# EAGLE board StearnsN2b (EAGLE 6.6.0)
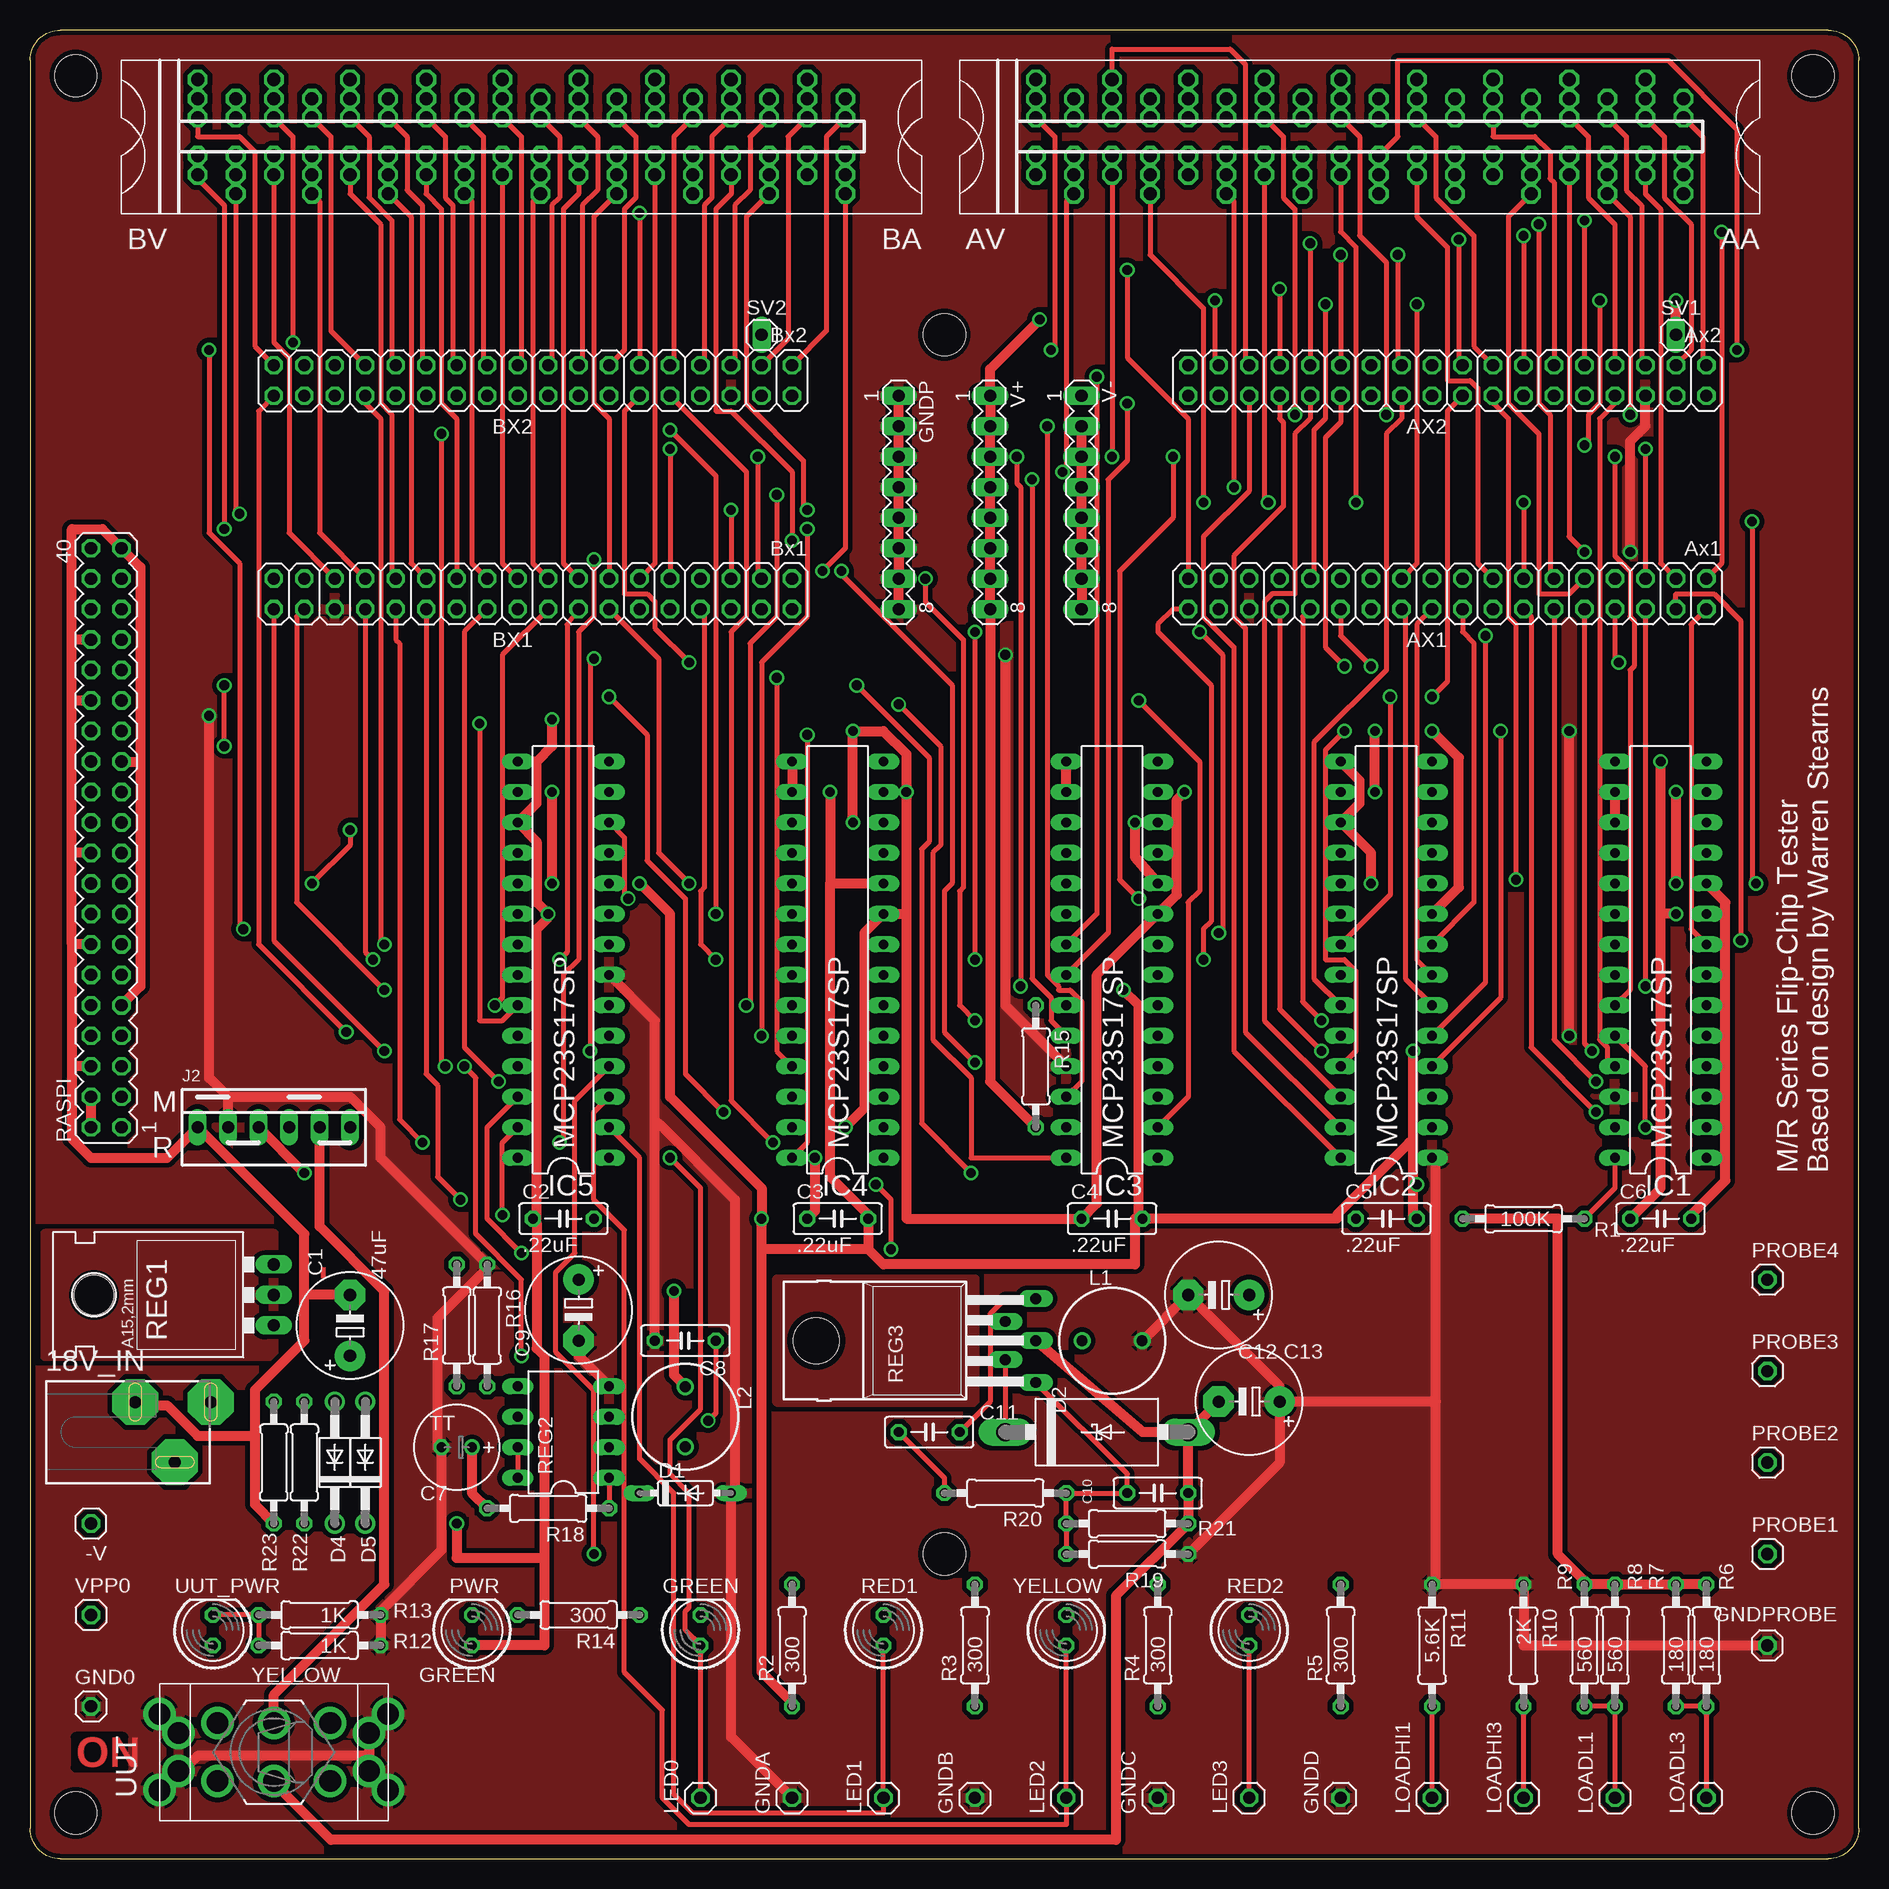
[diagram p1: board, top side]
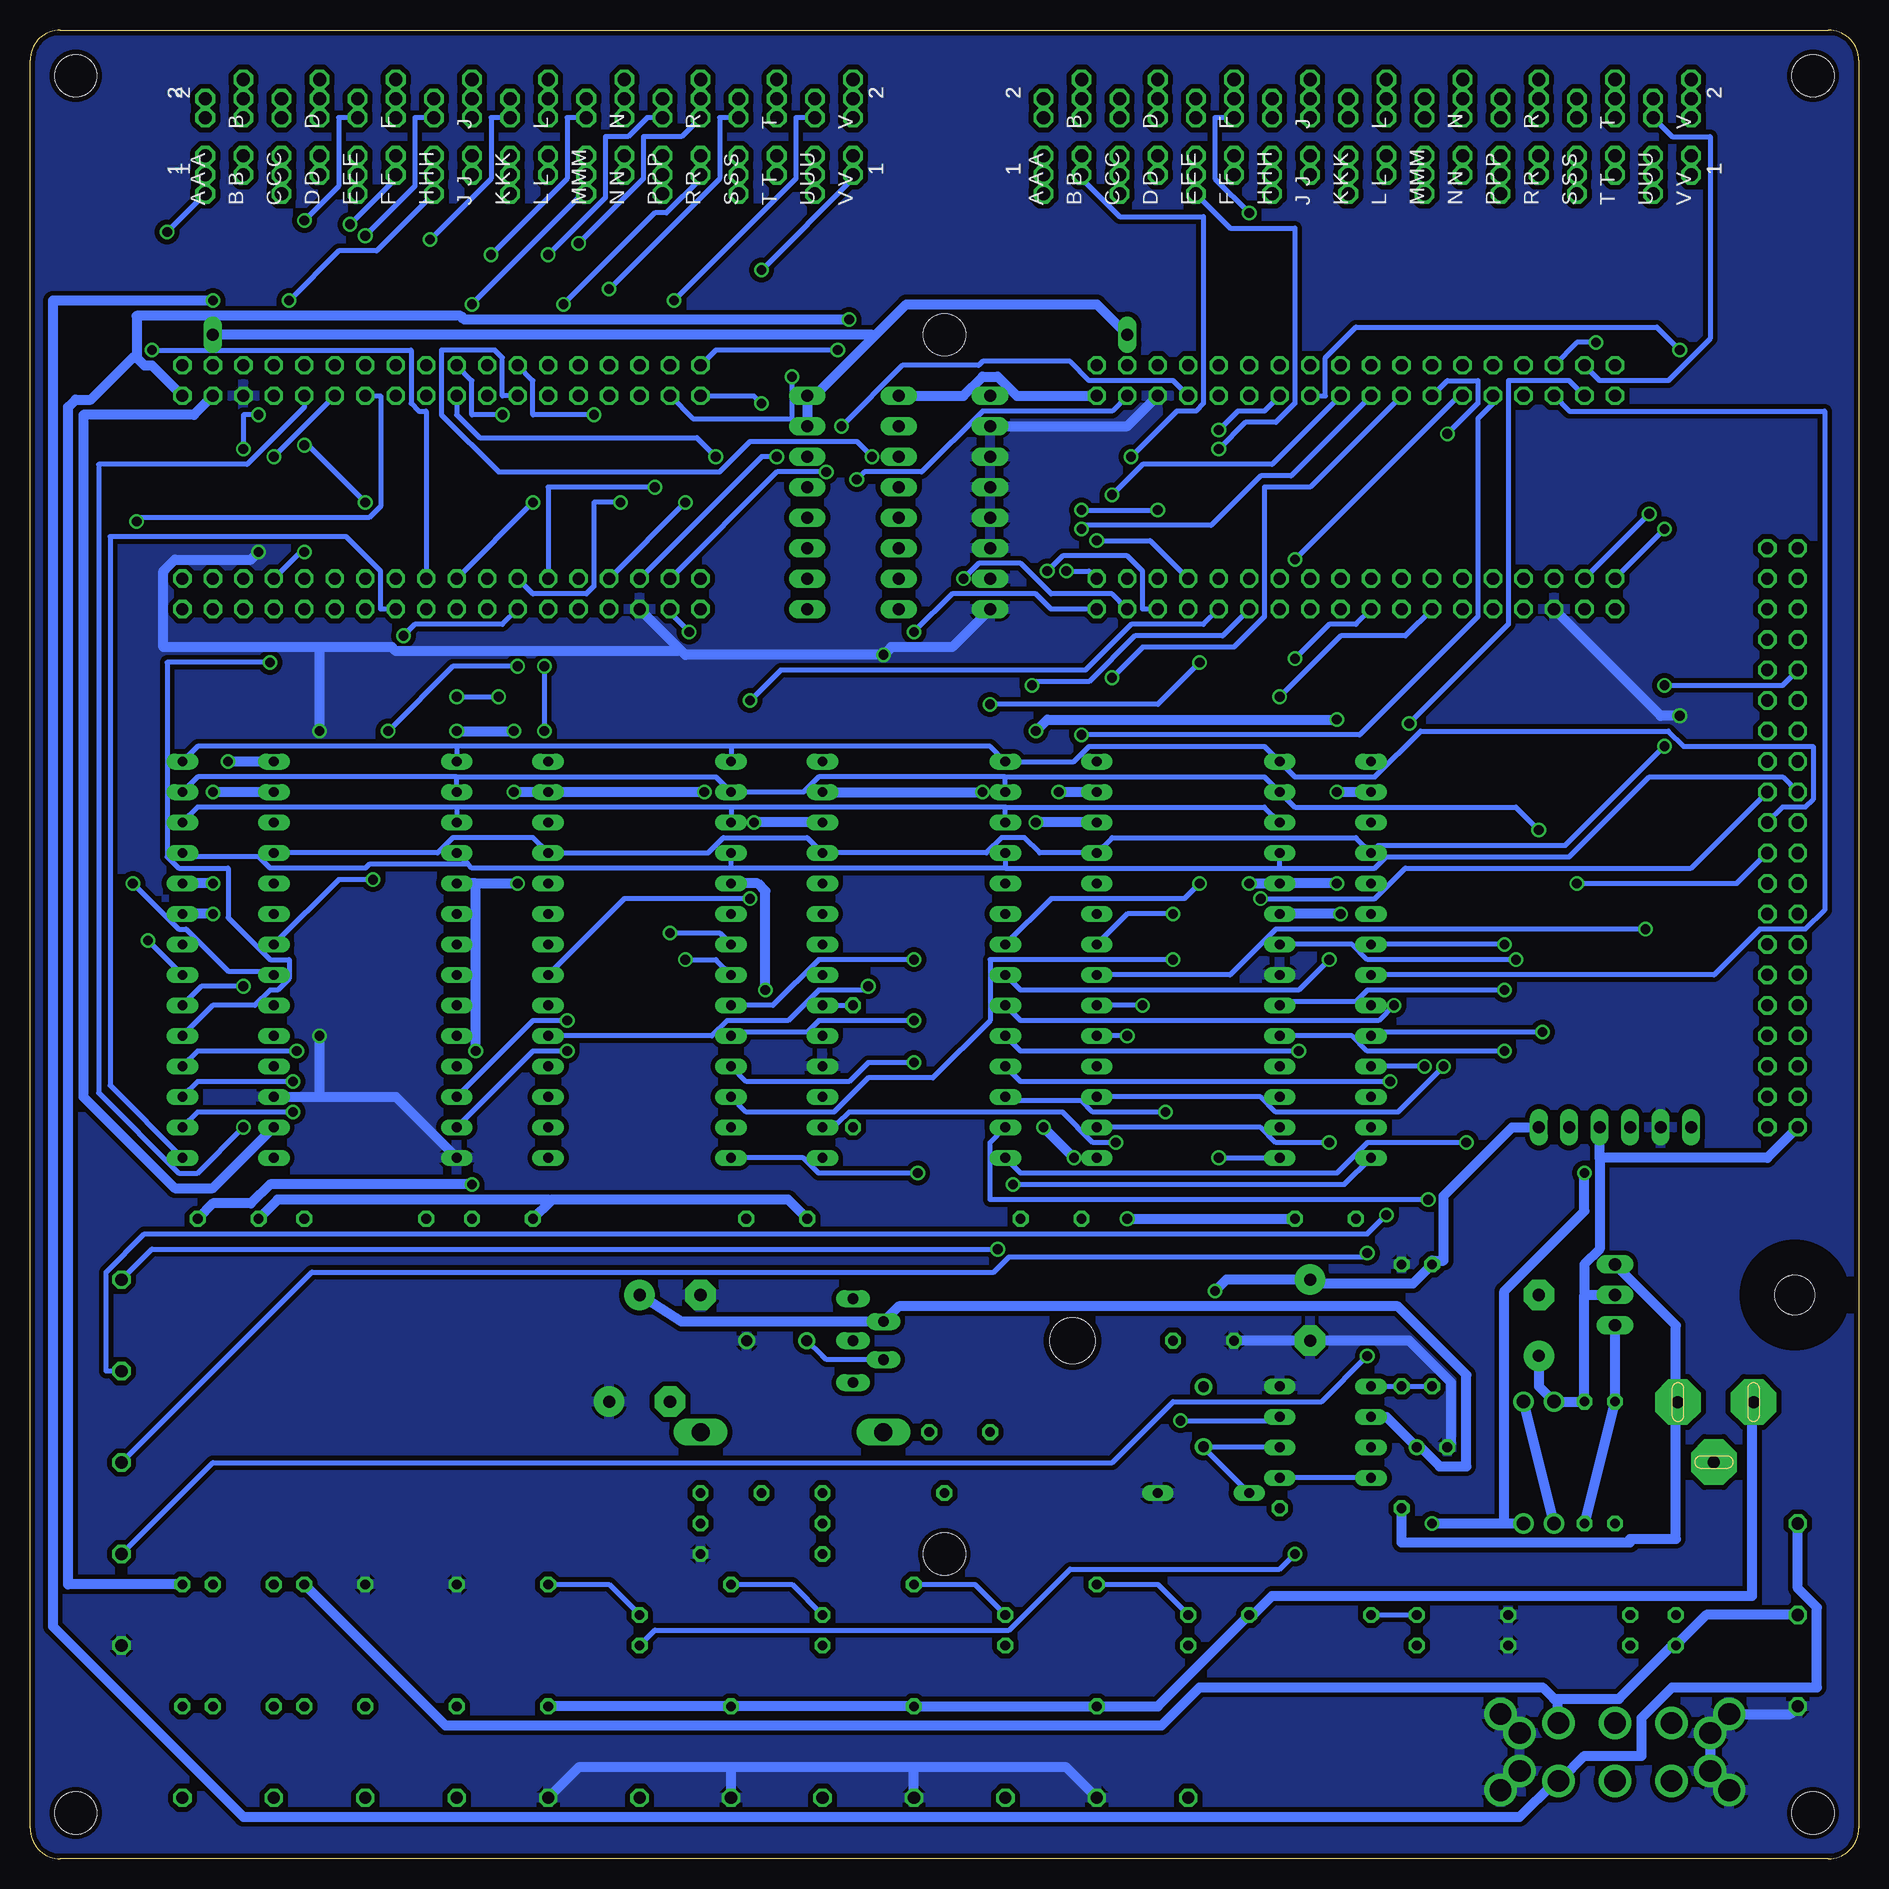
[diagram p2: board, bottom side, seen from below]

Size 152.4 x 152.4 mm. Coordinates in mm from the lower left corner, seen from the top.
Outline: 149.86,152.4 2.54,152.4 arc90 0,149.86 0,2.54 arc90 2.54,0 149.86,0 arc90 152.4,2.54 152.4,149.86 arc90 149.86,152.4
Copper layers (1+16): Top 0.035mm / dielectric 1.5mm / Bottom 0.035mm
Design rules "16mils *": minimum track width 16mil, minimum drill 32mil, track to track 15mil, track to pad 10mil, pad to pad 10mil, via to via 10mil, smd to smd 10mil, copper to edge 13mil, drill to drill 10mil, minimum pad ring 10mil, minimum via ring 8mil, stop-mask expansion 0mil, vias tented up to drill 0mil, thermal gap 10mil
Net classes: 1 Supply: width 0.813 mm
Holes 3.51 mm at 148.59,148.59 3.81,148.59 3.81,3.81 148.59,3.81 76.2,127 76.2,25.4
vRestrict: area 144.8,57.1 to 149.9,97.8

## Footprints (pad centres in the part's own frame; a part is rotated, then mirrored left to right if it is on the bottom)
SCD-014-A = drill 1 pad 3.81 octagon: 1 -2.5,13.8; 2 -2.5,7.5; 3 2.5,10.8
1X01 = drill 1.016 octagon: 1 0,0
2X18 = drill 1.016 octagon: 1 -21.59,-1.27; 2 -21.59,1.27; 3 -19.05,-1.27; 4 -19.05,1.27; 5 -16.51,-1.27; 6 -16.51,1.27; 7 -13.97,-1.27; 8 -13.97,1.27; 9 -11.43,-1.27; 10 -11.43,1.27; 11 -8.89,-1.27; 12 -8.89,1.27; 13 -6.35,-1.27; 14 -6.35,1.27; 15 -3.81,-1.27; 16 -3.81,1.27; 17 -1.27,-1.27; 18 -1.27,1.27; 19 1.27,-1.27; 20 1.27,1.27; 21 3.81,-1.27; 22 3.81,1.27; 23 6.35,-1.27; 24 6.35,1.27; 25 8.89,-1.27; 26 8.89,1.27; 27 11.43,-1.27; 28 11.43,1.27; 29 13.97,-1.27; 30 13.97,1.27; 31 16.51,-1.27; 32 16.51,1.27; 33 19.05,-1.27; 34 19.05,1.27; 35 21.59,-1.27; 36 21.59,1.27
E5-8,5 = drill 1.016 pad 2.54: + -2.54,0 | drill 1.016 pad 2.54 octagon: - 2.54,0
C050-025X075 = drill 0.813 octagon: 1 -2.54,0; 2 2.54,0
TT2D7 = drill 0.813: + -1.27,0 | drill 0.813 octagon: - 1.27,0
DO35-7 = drill 0.813 long: A 3.81,0; C -3.81,0
DO201T15 = drill 1.499 long: A 7.62,0; C -7.62,0
DO41-10 = drill 1.118: A 5.08,0; C -5.08,0
H807-2 = drill 1.092 octagon: AA1 4.763,60.325; AA2 -1.587,60.325; AB1 1.587,57.15; AB2 -4.763,57.15; AC1 4.763,53.975; AC2 -1.587,53.975; AD1 1.587,50.8; AD2 -4.763,50.8; AE1 4.763,47.625; AE2 -1.587,47.625; AF1 1.587,44.45; AF2 -4.763,44.45; AH1 4.763,41.275; AH2 -1.587,41.275; AJ1 1.587,38.1; AJ2 -4.763,38.1; AK1 4.763,34.925; AK2 -1.587,34.925; AL1 1.587,31.75; AL2 -4.763,31.75; AM1 4.763,28.575; AM2 -1.587,28.575; AN1 1.587,25.4; AN2 -4.763,25.4; AP1 4.763,22.225; AP2 -1.587,22.225; AR1 1.587,19.05; AR2 -4.763,19.05; AS1 4.763,15.875; AS2 -1.587,15.875; AT1 1.587,12.7; AT2 -4.763,12.7; AU1 4.763,9.525; AU2 -1.587,9.525; AV1 1.587,6.35; AV2 -4.763,6.35; BA1 4.763,-9.525; BA2 -1.587,-9.525; BB1 1.587,-12.7; BB2 -4.763,-12.7; BC1 4.763,-15.875; BC2 -1.587,-15.875; BD1 1.587,-19.05; BD2 -4.763,-19.05; BE1 4.763,-22.225; BE2 -1.587,-22.225; BF1 1.587,-25.4; BF2 -4.763,-25.4; BH1 4.763,-28.575; BH2 -1.587,-28.575; BJ1 1.587,-31.75; BJ2 -4.763,-31.75; BK1 4.763,-34.925; BK2 -1.587,-34.925; BL1 1.587,-38.1; BL2 -4.763,-38.1; BM1 4.763,-41.275; BM2 -1.587,-41.275; BN1 1.587,-44.45; BN2 -4.763,-44.45; BP1 4.763,-47.625; BP2 -1.587,-47.625; BR1 1.587,-50.8; BR2 -4.763,-50.8; BS1 4.763,-53.975; BS2 -1.587,-53.975; BT1 1.587,-57.15; BT2 -4.763,-57.15; BU1 4.763,-60.325; BU2 -1.587,-60.325; BV1 1.587,-63.5; BV2 -4.763,-63.5
ECS2418-2 = drill 1.092 octagon: AA1 1.587,60.325; AA2 -1.587,60.325; AB1 1.587,57.15; AB2 -1.587,57.15; AC1 1.587,53.975; AC2 -1.587,53.975; AD1 1.587,50.8; AD2 -1.587,50.8; AE1 1.587,47.625; AE2 -1.587,47.625; AF1 1.587,44.45; AF2 -1.587,44.45; AH1 1.587,41.275; AH2 -1.587,41.275; AJ1 1.587,38.1; AJ2 -1.587,38.1; AK1 1.587,34.925; AK2 -1.587,34.925; AL1 1.587,31.75; AL2 -1.587,31.75; AM1 1.587,28.575; AM2 -1.587,28.575; AN1 1.587,25.4; AN2 -1.587,25.4; AP1 1.587,22.225; AP2 -1.587,22.225; AR1 1.587,19.05; AR2 -1.587,19.05; AS1 1.587,15.875; AS2 -1.587,15.875; AT1 1.587,12.7; AT2 -1.587,12.7; AU1 1.587,9.525; AU2 -1.587,9.525; AV1 1.587,6.35; AV2 -1.587,6.35; BA1 1.587,-9.525; BA2 -1.587,-9.525; BB1 1.587,-12.7; BB2 -1.587,-12.7; BC1 1.587,-15.875; BC2 -1.587,-15.875; BD1 1.587,-19.05; BD2 -1.587,-19.05; BE1 1.587,-22.225; BE2 -1.587,-22.225; BF1 1.587,-25.4; BF2 -1.587,-25.4; BH1 1.587,-28.575; BH2 -1.587,-28.575; BJ1 1.587,-31.75; BJ2 -1.587,-31.75; BK1 1.587,-34.925; BK2 -1.587,-34.925; BL1 1.587,-38.1; BL2 -1.587,-38.1; BM1 1.587,-41.275; BM2 -1.587,-41.275; BN1 1.587,-44.45; BN2 -1.587,-44.45; BP1 1.587,-47.625; BP2 -1.587,-47.625; BR1 1.587,-50.8; BR2 -1.587,-50.8; BS1 1.587,-53.975; BS2 -1.587,-53.975; BT1 1.587,-57.15; BT2 -1.587,-57.15; BU1 1.587,-60.325; BU2 -1.587,-60.325; BV1 1.587,-63.5; BV2 -1.587,-63.5
EDAC346-36-2 = drill 1.092 octagon: AA1 3.175,60.325; AA2 -3.175,60.325; AB1 3.175,57.15; AB2 -3.175,57.15; AC1 3.175,53.975; AC2 -3.175,53.975; AD1 3.175,50.8; AD2 -3.175,50.8; AE1 3.175,47.625; AE2 -3.175,47.625; AF1 3.175,44.45; AF2 -3.175,44.45; AH1 3.175,41.275; AH2 -3.175,41.275; AJ1 3.175,38.1; AJ2 -3.175,38.1; AK1 3.175,34.925; AK2 -3.175,34.925; AL1 3.175,31.75; AL2 -3.175,31.75; AM1 3.175,28.575; AM2 -3.175,28.575; AN1 3.175,25.4; AN2 -3.175,25.4; AP1 3.175,22.225; AP2 -3.175,22.225; AR1 3.175,19.05; AR2 -3.175,19.05; AS1 3.175,15.875; AS2 -3.175,15.875; AT1 3.175,12.7; AT2 -3.175,12.7; AU1 3.175,9.525; AU2 -3.175,9.525; AV1 3.175,6.35; AV2 -3.175,6.35; BA1 3.175,-9.525; BA2 -3.175,-9.525; BB1 3.175,-12.7; BB2 -3.175,-12.7; BC1 3.175,-15.875; BC2 -3.175,-15.875; BD1 3.175,-19.05; BD2 -3.175,-19.05; BE1 3.175,-22.225; BE2 -3.175,-22.225; BF1 3.175,-25.4; BF2 -3.175,-25.4; BH1 3.175,-28.575; BH2 -3.175,-28.575; BJ1 3.175,-31.75; BJ2 -3.175,-31.75; BK1 3.175,-34.925; BK2 -3.175,-34.925; BL1 3.175,-38.1; BL2 -3.175,-38.1; BM1 3.175,-41.275; BM2 -3.175,-41.275; BN1 3.175,-44.45; BN2 -3.175,-44.45; BP1 3.175,-47.625; BP2 -3.175,-47.625; BR1 3.175,-50.8; BR2 -3.175,-50.8; BS1 3.175,-53.975; BS2 -3.175,-53.975; BT1 3.175,-57.15; BT2 -3.175,-57.15; BU1 3.175,-60.325; BU2 -3.175,-60.325; BV1 3.175,-63.5; BV2 -3.175,-63.5
MA08-1 = drill 1.016 long: 1 -8.89,0; 2 -6.35,0; 3 -3.81,0; 4 -1.27,0; 5 1.27,0; 6 3.81,0; 7 6.35,0; 8 8.89,0
LED5MM = drill 0.813 octagon: A -1.27,0; K 1.27,0
DIL28-3 = drill 0.813 long: 1 -16.51,-3.81; 2 -13.97,-3.81; 3 -11.43,-3.81; 4 -8.89,-3.81; 5 -6.35,-3.81; 6 -3.81,-3.81; 7 -1.27,-3.81; 8 1.27,-3.81; 9 3.81,-3.81; 10 6.35,-3.81; 11 8.89,-3.81; 12 11.43,-3.81; 13 13.97,-3.81; 14 16.51,-3.81; 15 16.51,3.81; 16 13.97,3.81; 17 11.43,3.81; 18 8.89,3.81; 19 6.35,3.81; 20 3.81,3.81; 21 1.27,3.81; 22 -1.27,3.81; 23 -3.81,3.81; 24 -6.35,3.81; 25 -8.89,3.81; 26 -11.43,3.81; 27 -13.97,3.81; 28 -16.51,3.81
22-23-2061 = drill 1 long: 1 -6.35,0; 2 -3.81,0; 3 -1.27,0; 4 1.27,0; 5 3.81,0; 6 6.35,0
6000-XXXX-RC = drill 0.9 pad 1.422: 1 -2.5,0; 2 2.5,0
0207/10 = drill 0.813 octagon: 1 -5.08,0; 2 5.08,0
MA20-2 = drill 1.016 octagon: 1 -24.13,-1.27; 2 -24.13,1.27; 3 -21.59,-1.27; 4 -21.59,1.27; 5 -19.05,-1.27; 6 -19.05,1.27; 7 -16.51,-1.27; 8 -16.51,1.27; 9 -13.97,-1.27; 10 -13.97,1.27; 11 -11.43,-1.27; 12 -11.43,1.27; 13 -8.89,-1.27; 14 -8.89,1.27; 15 -6.35,-1.27; 16 -6.35,1.27; 17 -3.81,-1.27; 18 -3.81,1.27; 19 -1.27,-1.27; 20 -1.27,1.27; 21 1.27,-1.27; 22 1.27,1.27; 23 3.81,-1.27; 24 3.81,1.27; 25 6.35,-1.27; 26 6.35,1.27; 27 8.89,-1.27; 28 8.89,1.27; 29 11.43,-1.27; 30 11.43,1.27; 31 13.97,-1.27; 32 13.97,1.27; 33 16.51,-1.27; 34 16.51,1.27; 35 19.05,-1.27; 36 19.05,1.27; 37 21.59,-1.27; 38 21.59,1.27; 39 24.13,-1.27; 40 24.13,1.27
TO220L1 = drill 1.016 long: 1 -2.54,-3.81; 2 0,-3.81; 3 2.54,-3.81 | hole 3.302: 0,11.176
DIL08 = drill 0.813 long: 1 -3.81,-3.81; 2 -1.27,-3.81; 3 1.27,-3.81; 4 3.81,-3.81; 5 3.81,3.81; 6 1.27,3.81; 7 -1.27,3.81; 8 -3.81,3.81
TO220-52 = drill 0.9 long: 1 -3.493,-10.16; 2 -1.587,-7.62; 3 0,-10.16; 4 1.587,-7.62; 5 3.493,-10.16 | hole 3.8: 0,8.14
MA01-1 = drill 1.016 long: 1 0,0
7209MD9V3 = drill 1.803: 1 -2.413,4.699; 2 -2.413,0; 3 -2.413,-4.699; 4 2.413,4.699; 5 2.413,0; 6 2.413,-4.699; NC@1 -3.175,9.525; NC@2 -1.587,7.938; NC@3 3.175,9.525; NC@4 1.587,7.938; NC@5 -3.175,-9.525; NC@6 -1.587,-7.938; NC@7 1.587,-7.938; NC@8 3.175,-9.525

## Placement (x,y rotation side)
18V_IN  RAPC712X  [SCD-014-A]  1.27,35.56 270 top
-V  [1X01]  5.08,27.94 180 top
AX1  Ax1  [2X18]  118.11,105.41 180 top
AX2  Ax2  [2X18]  118.11,123.19 180 top
BX1  Bx1  [2X18]  41.91,105.41 180 top
BX2  Bx2  [2X18]  41.91,123.19 180 top
C1  47uF  [E5-8,5]  26.67,44.45 90 top
C2  .22uF  [C050-025X075]  44.45,53.34 0 top
C3  .22uF  [C050-025X075]  67.31,53.34 0 top
C4  .22uF  [C050-025X075]  90.17,53.34 0 top
C5  .22uF  [C050-025X075]  113.03,53.34 0 top
C6  .22uF  [C050-025X075]  135.89,53.34 0 top
C7  100uF  [TT2D7]  35.56,34.29 180 top
C8  .22uF  [C050-025X075]  54.61,43.18 180 top
C9  470uF  [E5-8,5]  45.72,45.72 270 top
C10  47nF  [C050-025X075]  93.98,30.48 0 top
C11  470nF  [C050-025X075]  74.93,35.56 0 top
C12  470uF  [E5-8,5]  99.06,46.99 180 top
C13  470uF  [E5-8,5]  101.6,38.1 180 top
D1  1N5819  [DO35-7]  54.61,30.48 0 top
D2  1N5822  [DO201T15]  88.9,35.56 0 top
D4  1N4004  [DO41-10]  25.4,33.02 90 top
D5  1N4004  [DO41-10]  27.94,33.02 90 top
DEC  W971  [H807-2]  77.47,143.51 270 top
ECS  W971ECS  [ECS2418-2]  77.47,143.51 270 top
EDAC  W971EDAC  [EDAC346-36-2]  77.47,143.51 270 top
GND0  [1X01]  5.08,12.7 0 top
GNDA  [1X01]  63.5,5.08 90 top
GNDB  [1X01]  78.74,5.08 90 top
GNDC  [1X01]  93.98,5.08 90 top
GNDD  [1X01]  109.22,5.08 90 top
GNDP  GND  [MA08-1]  72.39,113.03 270 top
GNDPROBE  [1X01]  144.78,17.78 180 top
GREEN  [LED5MM]  55.88,19.05 90 top
IC1  MCP23S17SP  [DIL28-3]  135.89,74.93 90 top
IC2  MCP23S17SP  [DIL28-3]  113.03,74.93 90 top
IC3  MCP23S17SP  [DIL28-3]  90.17,74.93 90 top
IC4  MCP23S17SP  [DIL28-3]  67.31,74.93 90 top
IC5  MCP23S17SP  [DIL28-3]  44.45,74.93 90 top
J2  CONFIG  [22-23-2061]  20.32,60.96 0 top
L1  220uH  [6000-XXXX-RC]  90.17,43.18 0 top
L2  220uH  [6000-XXXX-RC]  54.61,36.83 90 top
LED0  [1X01]  55.88,5.08 90 top
LED1  [1X01]  71.12,5.08 90 top
LED2  [1X01]  86.36,5.08 90 top
LED3  [1X01]  101.6,5.08 90 top
LOADHI1  [1X01]  116.84,5.08 90 top
LOADHI3  [1X01]  124.46,5.08 90 top
LOADL1  [1X01]  132.08,5.08 90 top
LOADL3  [1X01]  139.7,5.08 90 top
PROBE1  [1X01]  144.78,25.4 0 top
PROBE2  [1X01]  144.78,33.02 0 top
PROBE3  [1X01]  144.78,40.64 0 top
PROBE4  [1X01]  144.78,48.26 0 top
PWR  GREEN  [LED5MM]  36.83,19.05 90 top
R1  100K  [0207/10]  124.46,53.34 180 top
R2  300  [0207/10]  63.5,17.78 90 top
R3  300  [0207/10]  78.74,17.78 90 top
R4  300  [0207/10]  93.98,17.78 90 top
R5  300  [0207/10]  109.22,17.78 90 top
R6  180  [0207/10]  139.7,17.78 90 top
R7  180  [0207/10]  137.16,17.78 90 top
R8  560  [0207/10]  132.08,17.78 90 top
R9  560  [0207/10]  129.54,17.78 90 top
R10  2K  [0207/10]  124.46,17.78 270 top
R11  5.6K  [0207/10]  116.84,17.78 270 top
R12  1K  [0207/10]  24.13,17.78 180 top
R13  1K  [0207/10]  24.13,20.32 180 top
R14  300  [0207/10]  45.72,20.32 180 top
R15  100K  [0207/10]  83.82,66.04 270 top
R16  1.2K  [0207/10]  38.1,44.45 270 top
R17  8.4K  [0207/10]  35.56,44.45 90 top
R18  0.33  [0207/10]  43.18,29.21 0 top
R19  4.7K  [0207/10]  91.44,25.4 0 top
R20  4.7K  [0207/10]  81.28,30.48 0 top
R21  2.4K  [0207/10]  91.44,27.94 0 top
R22  270  [0207/10]  22.86,33.02 90 top
R23  820  [0207/10]  20.32,33.02 90 top
RASPI  RasPi  [MA20-2]  6.35,85.09 90 top
RED1  [LED5MM]  71.12,19.05 90 top
RED2  [LED5MM]  101.6,19.05 90 top
REG1  LM338  [TO220L1]  16.51,46.99 90 top
REG2  MC33063/MC34063P  [DIL08]  44.45,35.56 90 top
REG3  MC34166  [TO220-52]  73.66,43.18 90 top
SV1  MA01-1  [MA01-1]  137.16,127 0 top
SV2  MA01-1  [MA01-1]  60.96,127 0 top
UUT  720X  [7209MD9V3]  20.32,8.89 90 top
UUT_PWR  YELLOW  [LED5MM]  15.24,19.05 90 top
V+  V+  [MA08-1]  80.01,113.03 270 top
V-  V-  [MA08-1]  87.63,113.03 270 top
VPP0  [1X01]  5.08,20.32 0 top
YELLOW  [LED5MM]  86.36,19.05 90 top

## Tracks (layer width: path | path; a pad name or v marks a point on that pad's centre or on a via)
!CE0!/GPIO8
  Bottom 0.406: 48.26,82.55 IC5.11 | 71.12,82.55 48.26,82.55 | IC4.11 71.12,82.55 | 93.98,82.55 IC3.11 | 71.12,82.55 93.98,82.55 | 115.89,82.87 115.57,82.55 93.98,82.55 | 115.89,82.87 IC2.11 | IC1.11 139.38,83.5 133.35,83.5 132.4,82.55 124.46,82.55 124.14,82.87 115.89,82.87 | RASPI.24 6.35,90.17 17.46,90.17 24.13,83.5 39.37,83.5 40.32,82.55 48.26,82.55
!RESET!/GPIO12  (via drill 0.81)
  Top 0.406: v16.19,92.71 v16.19,97.79
  Bottom 0.406: IC1.18 118.43,83.82 117.16,85.09 110.49,85.09 IC2.18 95.89,83.82 94.61,85.09 87.63,85.09 IC3.18 72.71,83.82 71.44,85.09 69.53,85.09 68.26,83.82 IC4.18 62.23,85.09 41.91,85.09 IC5.18 40.01,84.45 24.45,84.45 v16.19,92.71 | RASPI.32 6.35,97.79 v16.19,97.79
+10V  (via drill 0.81)
  Top 0.813: v53.66,47.31 53.66,40.32 54.61,39.37 L2.2
  Bottom 0.813: v53.66,47.31 52.7,48.26 C9.+ 45.72,47.94 37.15,47.94 R17.2 35.56,49.85 34.61,49.85 34.61,55.24 28.89,60.96 J2.6
+UB
  Top 0.813: R18.1 36.83,30.48 C7.+
  Bottom 0.813: REG2.6 39.37,36.83 C7.+ 36.51,34.29 34.92,32.7 32.7,32.7 32.7,40.32 38.42,46.04 80.01,46.04 REG3.4 98.11,44.77 C12.+ | R18.1 38.1,26.35 19.05,26.35 19.05,26.67 15.24,26.67 15.24,37.78 18V_IN.1 15.24,38.1 15.24,44.45 REG1.3
-15V
  Top 0.813: D2.A C10.2 R21.2 90.49,21.91 90.49,1.59 25.08,1.59 20.32,6.35 UUT.2 | REG3.3 92.71,35.56 D2.A | D2.A C13.-
AA1J
  Top 0.406: IC1.8 138.43,77.47 138.43,102.87 AX1.2
AB1J  (via drill 0.81)
  Top 0.406: v142.56,76.52 142.56,103.19 140.34,105.41 137.16,105.41 AX1.4
  Bottom 0.406: v142.56,76.52 IC1.7
AB2J
  Bottom 0.813: IC1.27 137.16,55.88 140.34,55.88 147.96,63.5 147.96,120.33 138.75,120.33 AX2.4
AC1J  (via drill 0.81)
  Top 0.406: AX1.6 v134.62,72.71
  Bottom 0.406: IC1.6 138.11,72.71 v134.62,72.71
AD1J  (via drill 0.81)
  Top 0.406: v132.4,99.69 132.08,100.01 AX1.8
  Bottom 0.406: IC1.5 137.16,71.12 133.67,71.12 132.4,72.39 131.76,72.39 130.81,73.34 130.81,74.93 132.4,74.93 135.89,78.42 135.89,82.55 140.02,82.55 140.97,83.5 140.97,99.69 v132.4,99.69
AD2J
  Top 0.406: IC1.25 131.44,66.67 131.44,67.63 130.81,68.26 130.81,120.02 132.08,121.28 AX2.8
AE1J  (via drill 0.81)
  Top 0.406: v130.18,67.31 129.54,67.94 AX1.10
  Bottom 0.406: IC1.4 138.43,67.31 v130.18,67.31
AE2J  (via drill 0.81)
  Top 0.406: IC1.24 134.62,66.04 v134.62,60.96
  Bottom 0.406: v134.62,60.96 138.43,57.15 140.02,57.15 146.69,63.82 146.69,116.2 134.3,116.2 129.54,120.97 AX2.10
AF1J  (via drill 0.81)
  Top 0.406: v130.49,64.77 127,68.26 AX1.12
  Bottom 0.406: IC1.3 138.43,64.77 v130.49,64.77
AF2J  (via drill 0.81)
  Top 0.406: IC1.23 133.35,72.39 133.35,99.06 133.67,99.38 133.67,103.19 133.35,103.5 133.35,107.31 132.08,108.58 v132.08,116.84
  Bottom 0.406: AX2.12 v132.08,116.84
AH1J  (via drill 0.81)
  Top 0.406: v130.49,62.23 125.09,67.63 125.09,103.5 AX1.14
  Bottom 0.406: IC1.2 138.43,62.23 v130.49,62.23
AH2J  (via drill 0.81)
  Top 0.406: v143.83,81.28 143.51,81.6 v143.51,111.44
  Bottom 0.406: IC1.22 132.4,73.98 135.89,73.98 139.38,77.47 140.02,77.47 v143.83,81.28 | v143.51,111.44 143.19,111.76 124.14,111.76 123.19,112.71 123.19,121.92 AX2.14
AJ1J
  Bottom 0.406: IC1.1 145.73,64.45 145.73,110.17 126.05,110.17 123.19,107.31 123.19,104.14 AX1.16
AJ2J  (via drill 0.81)
  Top 0.406: v123.83,81.6 123.83,102.87 123.19,103.5 123.19,120.02 121.92,121.28 AX2.16
  Bottom 0.406: IC1.21 126.68,81.6 v123.83,81.6
AK1J
  Top 0.406: IC2.8 120.33,79.69 120.33,101.28 119.38,102.23 AX1.18
AK2J  (via drill 0.81)
  Top 0.406: IC2.21 113.35,80.33 v113.35,96.84 | v116.84,96.84 118.11,98.11 118.11,120.65 AX2.18
  Bottom 0.406: v116.84,96.84 v113.35,96.84
AL1J
  Top 0.406: IC2.7 115.57,74.93 115.57,102.87 AX1.20
AL2J  (via drill 0.81)
  Top 0.406: v92.39,80.01 90.81,81.6 90.81,107.31 95.25,111.76 v95.25,116.84
  Bottom 0.406: IC2.22 102.87,80.01 v92.39,80.01 | v95.25,116.84 96.84,118.43 114.94,118.43 116.84,120.33 AX2.20
AM1J
  Top 0.406: IC2.6 114.62,73.34 114.62,103.82 AX1.22
AM2J
  Top 0.406: IC2.23 107,73.34 107,93.03 113.03,99.06 113.03,118.75 114.3,120.02 AX2.22
AN1J  (via drill 0.81)
  Top 0.406: IC2.5 121.28,73.03 v121.28,101.92
  Bottom 0.406: v121.28,101.92 120.33,102.87 113.03,102.87 AX1.24
AN2J  (via drill 0.81)
  Top 0.406: v82.55,72.71 82.55,114.3 82.23,114.62 v82.23,116.84
  Bottom 0.406: IC2.24 95.57,68.58 94.3,69.85 89.22,69.85 86.68,72.39 82.87,72.39 v82.55,72.71 | v82.23,116.84 83.5,118.11 92.39,118.11 94.93,115.57 113.35,115.57 118.11,120.33 118.11,125.73 113.67,125.73 113.03,125.09 113.03,121.92 AX2.24
AP1J  (via drill 0.81)
  Top 0.406: IC2.4 122.56,71.75 v122.56,93.98 | v111.76,99.38 109.22,101.92 AX1.26
  Bottom 0.406: v122.56,93.98 117.16,99.38 v111.76,99.38
AP2J  (via drill 0.81)
  Top 0.406: IC2.25 110.49,67.31 110.49,73.98 109.54,74.93 107.95,74.93 107.95,92.39 v109.54,93.98 | v109.54,99.38 107.95,100.97 107.95,118.43 109.22,119.7 AX2.26
  Bottom 0.406: v109.54,99.38 v109.54,93.98
AR1J  (via drill 0.81)
  Top 0.406: v107.63,69.85 106.05,71.44 106.05,103.5 AX1.28
  Bottom 0.406: IC2.3 110.49,69.85 v107.63,69.85
AR2J
  Top 0.406: IC2.26 102.87,69.85 102.87,104.78 103.5,105.41 105.41,105.41 105.41,118.75 106.68,120.02 AX2.28
AS1J  (via drill 0.81)
  Top 0.406: v107.63,67.31 104.14,70.8 AX1.30
  Bottom 0.406: IC2.2 110.49,67.31 v107.63,67.31
AS2J
  Top 0.406: IC2.27 101.28,68.9 101.28,102.55 100.33,103.5 100.33,108.58 104.46,112.71 104.46,119.7 104.14,120.02 AX2.30
AT2J
  Top 0.406: IC2.28 100.33,67.31 100.33,100.97 97.79,103.5 97.79,110.17 101.6,113.98 AX2.32
AU1J  (via drill 0.81)
  Top 0.406: v99.06,77.15 99.38,77.47 99.38,100.33 v97.47,102.23
  Bottom 0.406: IC3.8 94.93,77.15 v99.06,77.15 | v97.47,102.23 99.06,103.82 AX1.34
AU2J  (via drill 0.81)
  Top 0.406: IC3.21 88.9,78.74 v88.9,123.51
  Bottom 0.406: v88.9,123.51 88.9,120.02 97.16,120.02 AX2.34
AV1J  (via drill 0.81)
  Top 0.406: v97.79,74.93 97.79,77.47 98.42,78.11 98.42,97.79 93.98,102.23 93.98,102.87 95.25,104.14 AX1.36
  Bottom 0.406: IC3.7 95.25,74.93 v97.79,74.93
AV2J  (via drill 0.81)
  Top 0.406: IC3.22 89.85,77.15 89.85,114.94 91.44,116.52 v91.44,121.28
  Bottom 0.406: v91.44,121.28 92.08,121.92 AX2.36
BA1J  (via drill 0.81)
  Top 0.406: v78.74,102.23 v78.74,74.93
  Bottom 0.406: IC3.6 90.49,71.12 86.68,74.93 v78.74,74.93 | v78.74,102.23 75.56,105.41 68.58,105.41 67.31,104.14 BX1.2
BB1J  (via drill 0.81)
  Top 0.406: v78.74,69.85 77.47,71.12 77.47,80.64 77.79,80.96 77.79,101.6 74.61,104.78 v74.61,106.68
  Bottom 0.406: IC3.5 93.66,68.9 87.63,68.9 86.68,69.85 v78.74,69.85 | v74.61,106.68 73.34,107.95 69.85,107.95 67.31,105.41 62.23,105.41 BX1.4
BB2J  (via drill 0.81)
  Top 0.406: IC3.24 85.09,69.85 85.09,71.75 83.5,73.34 v83.5,114.94
  Bottom 0.406: v83.5,114.94 82.87,115.57 78.11,115.57 73.03,120.65 62.23,120.65 BX2.4
BC1J  (via drill 0.81)
  Top 0.406: v78.74,66.36 76.2,68.9 76.2,80.64 76.83,81.28 76.83,97.79 67.63,107 v67.63,107.31
  Bottom 0.406: IC3.4 92.71,64.77 84.14,64.77 82.55,66.36 v78.74,66.36 | v67.63,107.31 66.36,108.58 60.96,108.58 59.69,107.31 59.69,104.14 BX1.6
BD1J  (via drill 0.81)
  Top 0.406: v57.15,74.93 55.88,76.2 55.88,80.64 56.2,80.96 56.2,103.82 BX1.8
  Bottom 0.406: IC3.3 92.71,62.23 85.41,62.23 82.55,65.09 77.15,65.09 72.39,69.85 72.39,74.93 v57.15,74.93
BD2J  (via drill 0.81)
  Top 0.406: IC3.26 87.63,64.77 87.63,71.44 86.68,72.39 85.72,72.39 85.72,72.71 84.77,73.66 v84.77,119.38
  Bottom 0.406: v84.77,119.38 79.69,124.46 73.34,124.46 73.03,124.78 65.72,124.78 64.14,123.19 57.15,123.19 BX2.8
BE1J  (via drill 0.81)
  Top 0.406: IC3.2 96.52,63.5 96.52,79.69 97.47,80.64 97.47,91.44 v92.39,96.52
  Bottom 0.406: v92.39,96.52 89.85,99.06 64.45,99.06 60.64,102.87 54.61,102.87 BX1.10
BE2J  (via drill 0.81)
  Top 0.406: v61.91,59.69 58.42,63.18 58.42,102.23 59.69,103.5 59.69,115.57 BX2.10
  Bottom 0.406: IC3.27 86.04,61.28 85.09,61.28 84.14,62.23 66.36,62.23 63.82,59.69 v61.91,59.69
BF1J  (via drill 0.81)
  Top 0.406: v78.42,57.15 74.3,61.28 74.3,84.14 74.93,84.77 74.93,91.76 v68.9,97.79
  Bottom 0.406: IC3.1 87.95,58.42 86.68,57.15 v78.42,57.15 | v68.9,97.79 68.58,98.11 64.14,98.11 60.33,101.92 53.02,101.92 BX1.12
BF2J  (via drill 0.81)
  Top 0.406: IC3.28 78.42,58.42 78.42,65.09 75.25,68.26 75.25,83.82 75.88,84.45 75.88,92.71 v72.39,96.2 | v54.93,99.69 52.07,102.55 52.07,104.78 51.44,105.41 49.53,105.41 49.53,120.65 BX2.12
  Bottom 0.406: v72.39,96.2 58.42,96.2 v54.93,99.69
BH1J  (via drill 0.81)
  Top 0.406: v54.93,81.28 52.39,83.82 52.39,100.01 BX1.14
  Bottom 0.406: IC4.8 67.31,80.01 56.2,80.01 v54.93,81.28
BH2J  (via drill 0.81)
  Top 0.406: v57.15,78.74 57.15,115.25 v53.34,119.06
  Bottom 0.406: IC4.21 60.96,78.74 v57.15,78.74 | v53.34,119.06 51.75,120.65 49.53,120.65 BX2.14
BJ1J  (via drill 0.81)
  Top 0.406: v44.13,74.93 44.77,75.56 44.77,102.87 BX1.16
  Bottom 0.406: IC4.7 69.85,72.39 46.67,72.39 v44.13,74.93
BJ2J  (via drill 0.81)
  Top 0.406: v17.78,77.47 17.46,77.79 17.46,107.95 14.92,110.49 v14.92,125.73
  Bottom 0.406: IC4.22 52.39,73.66 48.58,77.47 v17.78,77.47 | v14.92,125.73 16.83,127.64 41.91,127.64 44.45,125.09 44.45,121.92 BX2.16
BK1J  (via drill 0.81)
  Top 0.406: v38.73,71.12 39.37,71.75 39.37,100.33 BX1.18
  Bottom 0.406: IC4.6 69.85,69.85 40.01,69.85 v38.73,71.12
BK2J  (via drill 0.81)
  Top 0.406: v59.69,71.12 60.01,71.44 60.01,101.28 62.23,103.5 v62.23,113.67
  Bottom 0.406: v59.69,71.12 IC4.23 | v62.23,113.67 59.69,116.2 48.9,116.2 BX2.18
BL1J  (via drill 0.81)
  Top 0.406: v46.99,100.01 46.67,99.69 v46.67,67.31
  Bottom 0.406: IC4.5 69.85,67.31 v46.67,67.31 | v46.99,100.01 44.13,102.87 41.91,102.87 BX1.20
BL2J  (via drill 0.81)
  Top 0.406: v60.96,68.58 60.96,99.69 64.77,103.5 v64.77,110.81
  Bottom 0.406: v60.96,68.58 IC4.24 | v64.77,110.81 64.45,111.12 53.98,111.12 49.85,115.25 47.31,115.25 BX2.20
BM1J  (via drill 0.81)
  Top 0.406: v39.05,64.77 36.2,67.63 36.2,102.23 BX1.22
  Bottom 0.406: IC4.4 69.85,64.77 v39.05,64.77
BM2J  (via drill 0.81)
  Top 0.406: IC4.25 62.23,67.31 v62.23,98.42
  Bottom 0.406: v62.23,98.42 59.69,100.97 52.07,100.97 49.53,103.5 49.53,114.3 45.72,114.3 BX2.22
BN1J  (via drill 0.81)
  Top 0.406: v57.78,62.23 54.61,65.41 54.61,80.01 51.44,83.19 51.44,93.66 v48.26,96.84
  Bottom 0.406: IC4.3 70.8,63.18 64.77,63.18 63.82,62.23 v57.78,62.23 | v48.26,96.84 43.18,101.92 37.78,101.92 BX1.24
BN2J  (via drill 0.81)
  Top 0.406: v34.61,66.04 34.29,66.36 v34.29,118.75
  Bottom 0.406: IC4.26 49.85,63.5 48.58,62.23 38.42,62.23 v34.61,66.04 | v34.29,118.75 31.75,121.28 31.75,123.19 34.29,123.19 BX2.24
BP1J  (via drill 0.81)
  Top 0.406: v35.88,54.93 33.97,56.83 33.97,64.45 33.02,65.41 BX1.26
  Bottom 0.406: IC4.2 72.39,59.69 72.39,54.93 v35.88,54.93
BP2J  (via drill 0.81)
  Top 0.406: v44.13,59.69 44.45,60.01 44.45,73.66 45.72,74.93 45.72,102.23 46.99,103.5 v46.99,108.27
  Bottom 0.406: IC4.27 49.85,60.96 48.58,59.69 v44.13,59.69 | v46.99,108.27 33.34,121.92 BX2.26
BR1J  (via drill 0.81)
  Top 0.406: v32.7,59.69 30.8,61.59 30.8,101.28 30.48,101.6 BX1.28
  Bottom 0.406: IC4.1 69.85,57.15 43.5,57.15 40.96,59.69 v32.7,59.69
BR2J  (via drill 0.81)
  Top 0.406: IC4.28 64.77,59.69 v64.77,93.66
  Bottom 0.406: v64.77,93.66 41.59,93.66 31.75,103.5 31.75,120.02 30.48,121.28 BX2.28
BS1J  (via drill 0.81)
  Top 0.406: v28.57,74.93 27.94,75.56 BX1.30
  Bottom 0.406: IC5.8 42.23,76.2 40.96,74.93 v28.57,74.93
BS2J  (via drill 0.81)
  Top 0.406: v29.53,76.2 29.21,76.52 29.21,120.02 27.94,121.28 BX2.30
  Bottom 0.406: v29.53,76.2 IC5.21
BT2J
  Bottom 0.406: IC5.22 12.06,73.66 8.26,77.47 4.45,77.47 2.86,79.06 2.86,120.65 24.13,120.65 BX2.32
BU1J  (via drill 0.81)
  Top 0.406: v29.53,72.39 22.23,79.69 22.23,103.5 BX1.34
  Bottom 0.406: IC5.6 47.94,71.44 41.91,71.44 40.96,72.39 v29.53,72.39
BU2J  (via drill 0.81)
  Top 0.406: IC5.23 39.37,69.85 37.47,69.85 v37.47,94.61
  Bottom 0.406: v37.47,94.61 29.21,102.87 29.21,123.19 24.13,123.19 BX2.34
BV1J  (via drill 0.81)
  Top 0.406: v29.53,67.31 20.32,76.52 BX1.36
  Bottom 0.406: IC5.5 42.23,68.58 40.96,67.31 v29.53,67.31
BV2J  (via drill 0.81)
  Top 0.406: v26.35,68.9 19.05,76.2 19.05,120.65 BX2.36
  Bottom 0.406: IC5.24 40.32,68.9 v26.35,68.9
CLK/GPIO11  (via drill 0.81)
  Top 0.406: v49.85,80.01 49.53,80.33 49.53,85.09 IC5.12
  Bottom 0.406: IC5.12 49.53,87.63 71.12,87.63 | IC4.12 71.12,87.63 | 93.98,87.63 IC3.12 | 71.12,87.63 93.98,87.63 | 116.84,87.63 IC2.12 | 93.98,87.63 116.84,87.63 | IC1.12 138.43,87.63 116.84,87.63 | RASPI.23 13.97,82.55 37.78,82.55 40.32,80.01 v49.85,80.01
GND  (via drill 0.81)
  Top 0.813: GNDP.1 GNDP.2 GNDP.3 GNDP.4 GNDP.5 GNDP.6 GNDP.7 GNDP.8 | IC3.25 81.28,71.12 v81.28,100.33 | AX2.6 134.62,119.38 133.35,118.11 v133.35,108.9 | GNDPROBE.1 124.46,17.78 R10.1 R11.1 117.16,23.18 117.16,38.1 | REG2.4 45.72,41.91 C9.- | IC5.7 52.07,69.85 52.07,61.28 | C8.2 52.07,61.28 | UUT.NC@1 UUT.NC@2 12.7,7.3 13.97,8.57 27.94,8.57 UUT.NC@6 | UUT.NC@5 UUT.NC@6 | R12.1 R13.1 29.21,20.64 34.29,25.72 C7.- 33.97,34.29 33.97,45.09 38.1,49.21 R16.1 29.21,58.42 29.21,60.96 26.67,63.5 16.51,63.5 | UUT.NC@6 UUT.NC@7 UUT.NC@8 | v128.27,68.58 v128.27,93.98 | IC2.1 117.16,58.1 117.16,38.1 | v14.92,95.25 14.92,65.09 16.51,63.5 | J2.2 16.51,63.5 | 52.07,61.28 52.39,61.28 58.74,54.93 58.74,30.8 D1.A 58.42,10.16 GNDA.1 | R19.2 104.14,33.02 C13.+ | 117.16,38.1 C13.+ | C13.+ 104.14,39.37 C12.- 92.71,43.18 92.71,43.22 L1.2
  Bottom 0.813: BX2.6 60.96,119.38 GNDP.2 | GNDP.8 75.56,100.97 80.64,100.97 v81.28,100.33 97.79,100.33 98.27,100.81 | 98.27,100.81 AX1.32 | v133.35,108.9 133.99,108.27 140.34,108.27 141.29,107.31 141.29,100.97 128.27,100.97 | 128.27,100.97 122.24,100.97 121.92,100.65 98.42,100.65 98.27,100.81 | IC2.1 121.92,63.5 128.27,63.5 | IC1.26 128.27,63.5 | C8.2 C9.- 37.47,43.18 33.97,39.69 33.97,34.61 C7.- | GND0.1 5.71,12.06 UUT.NC@3 10.79,11.75 11.11,11.75 UUT.NC@4 UUT.NC@2 | v128.27,93.98 128.27,100.97 | 128.27,63.5 v128.27,68.58 | BX1.32 16.51,95.25 v14.92,95.25 | GNDA.1 66.04,7.62 78.74,7.62 | 78.74,7.62 93.98,7.62 | 93.98,7.62 106.68,7.62 GNDD.1 | GNDC.1 93.98,7.62 | GNDB.1 78.74,7.62
  pour Top (isolate 0.406, rank 2): 152.4,152.4 0,152.4 0,0 152.4,0
  pour Bottom (isolate 0.406): 152.4,152.4 0,152.4 0,0 152.4,0
LED0  (via drill 0.81)
  Top 0.406: LED0.1 GREEN.A 54.61,19.05 54.61,20.64 54.93,20.95 54.93,30.48 53.34,32.07 53.34,34.92 55.88,37.47 55.88,55.88 v53.34,58.42
  Bottom 0.406: v53.34,58.42 IC5.1
LED1
  Top 0.406: RED1.A LED1.1 71.12,3.81 55.24,3.81 53.66,5.4 53.66,30.48 50.8,33.34 50.8,58.42 IC5.2
LED2
  Top 0.406: YELLOW.A LED2.1 86.36,2.86 54.93,2.86 52.7,5.08 52.7,12.38 49.53,15.56 49.53,52.39 46.99,54.93 46.99,62.23 IC5.3
LED3  (via drill 0.81)
  Top 0.406: LED3.1 RED2.A | IC5.4 45.4,63.18 45.4,50.48 43.81,48.9 43.81,42.23 46.99,39.05 v46.99,25.4
  Bottom 0.406: v46.99,25.4 48.26,24.13 65.72,24.13 70.8,19.05 100.33,19.05 RED2.A
N$1  (via drill 0.81)
  Top 0.406: ECS.AA1 EDAC.AA1 DEC.AA1 | AX1.1 140.97,107.95 v140.97,135.57
  Bottom 0.406: DEC.AA1 v140.97,135.57
N$2  (via drill 0.81)
  Top 0.406: AX1.35 96.52,120.02 91.44,125.09 v91.44,132.4 | EDAC.AV1 ECS.AV1
  Bottom 0.406: v91.44,132.4 83.82,140.02 EDAC.AV1
N$3  (via drill 0.81)
  Top 0.406: ECS.AU1 EDAC.AU1 DEC.AU1 86.36,138.11 86.36,115.89 v86.04,115.57
  Bottom 0.406: AX1.33 90.17,115.57 v86.04,115.57
N$4  (via drill 0.81)
  Top 0.406: v90.17,116.84 EDAC.AT1 ECS.AT1
  Bottom 0.406: AX1.31 91.44,116.84 v90.17,116.84
N$5  (via drill 0.81)
  Top 0.406: ECS.AS1 EDAC.AS1 DEC.AS1 93.34,133.67 97.79,129.22 v97.79,113.03
  Bottom 0.406: v97.79,113.03 AX1.29
N$6  (via drill 0.81)
  Top 0.406: AX1.27 107,107 107,119.06 107.95,120.02 v107.95,129.54 | EDAC.AR1 ECS.AR1
  Bottom 0.406: v107.95,129.54 100.33,137.16 99.38,137.16 96.52,140.02 EDAC.AR1
N$7  (via drill 0.81)
  Top 0.406: ECS.AP1 EDAC.AP1 DEC.AP1 100.33,138.11 v100.33,114.3
  Bottom 0.406: AX1.25 109.22,114.3 v100.33,114.3
N$8  (via drill 0.81)
  Top 0.406: v103.19,113.03 102.87,113.35 EDAC.AN1 ECS.AN1
  Bottom 0.406: AX1.23 110.49,105.41 106.05,105.41 105.41,106.05 105.41,113.03 v103.19,113.03
N$9  (via drill 0.81)
  Top 0.406: ECS.AM1 EDAC.AM1 DEC.AM1 | AX1.21 115.57,107.95 v115.57,129.54
  Bottom 0.406: v115.57,129.54 106.36,138.75 DEC.AM1
N$10  (via drill 0.81)
  Top 0.406: v110.49,113.03 110.49,134.3 109.22,135.57 EDAC.AL1 ECS.AL1
  Bottom 0.406: v110.49,113.03 AX1.19
N$11  (via drill 0.81)
  Top 0.406: DEC.AK1 EDAC.AK1 ECS.AK1 113.98,143.51 113.98,149.86 136.53,149.86 142.24,144.15 v142.24,125.73
  Bottom 0.406: AX1.17 119.38,120.65 120.02,120.65 120.65,121.28 120.65,125.73 v142.24,125.73
N$12
  Top 0.406: AX1.15 120.65,107.95 120.65,122.56 120.02,123.19 118.11,123.19 118.11,134.3 115.57,136.84 EDAC.AJ1 ECS.AJ1
N$13  (via drill 0.81)
  Top 0.406: ECS.AH1 EDAC.AH1 DEC.AH1 | v124.46,113.03 AX1.13 | v129.54,117.79 129.86,118.11 129.86,120.33 130.81,121.28 v130.81,129.86
  Bottom 0.406: v124.46,113.03 129.22,117.79 v129.54,117.79 | v130.81,129.86 126.68,133.99 123.51,133.99 DEC.AH1
N$14  (via drill 0.81)
  Top 0.406: AX1.11 126.68,107 126.68,120.33 125.73,121.28 v125.73,136.21 | EDAC.AF1 ECS.AF1
  Bottom 0.406: v125.73,136.21 121.92,140.02 EDAC.AF1
N$15
  Top 0.406: ECS.AE1 EDAC.AE1 DEC.AE1 123.19,136.84 123.19,121.28 125.73,118.75 125.73,105.41 128.27,105.41 AX1.9
N$16  (via drill 0.81)
  Top 0.406: v129.54,108.9 128.27,110.17 EDAC.AD1 ECS.AD1
  Bottom 0.406: AX1.7 129.86,108.9 v129.54,108.9
N$17  (via drill 0.81)
  Top 0.406: ECS.AC1 EDAC.AC1 DEC.AC1 133.35,136.84 v133.35,120.33 | v134.62,117.47 AX1.5
  Bottom 0.406: v134.62,117.47 134.62,120.33 v133.35,120.33
N$18
  Top 0.406: AX1.3 135.89,107.95 135.89,137.48 134.62,138.75 EDAC.AB1 ECS.AB1
N$19
  Top 0.406: AX2.1 139.38,124.78 139.38,143.51 ECS.AA2 EDAC.AA2
N$20
  Top 0.406: DEC.AB2 EDAC.AB2 ECS.AB2 136.21,143.51 136.21,138.43 138.43,136.21 138.43,125.73 AX2.3
N$21
  Top 0.406: AX2.5 134.3,124.78 134.3,137.79 133.03,139.06 133.03,143.51 ECS.AC2 EDAC.AC2
N$22
  Top 0.406: DEC.AD2 EDAC.AD2 ECS.AD2 129.86,143.51 129.86,138.43 132.08,136.21 AX2.7
N$23  (via drill 0.81)
  Top 0.406: v129.54,136.53 AX2.9 | ECS.AE2 EDAC.AE2
  Bottom 0.406: v129.54,136.53 126.68,139.38 126.68,145.1 ECS.AE2
N$24
  Top 0.406: DEC.AF2 EDAC.AF2 ECS.AF2 121.92,143.51 125.41,143.51 126.68,142.24 126.68,140.02 127,139.7 AX2.11
N$25  (via drill 0.81)
  Top 0.406: v124.46,135.25 AX2.13 | ECS.AH2 EDAC.AH2
  Bottom 0.406: v124.46,135.25 120.33,139.38 120.33,145.1 ECS.AH2
N$26
  Top 0.406: DEC.AJ2 EDAC.AJ2 ECS.AJ2 117.16,143.51 117.16,138.43 120.33,135.25 120.33,126.05 AX2.15
N$27  (via drill 0.81)
  Top 0.406: AX2.17 119.06,124.78 v119.06,134.94 | ECS.AK2 EDAC.AK2
  Bottom 0.406: v119.06,134.94 113.98,140.02 113.98,145.1 ECS.AK2
N$28  (via drill 0.81)
  Top 0.406: DEC.AL2 EDAC.AL2 ECS.AL2 110.81,143.51 110.81,135.25 113.03,133.03 v113.03,120.33
  Bottom 0.406: AX2.19 115.57,123.19 115.57,120.33 v113.03,120.33
N$29  (via drill 0.81)
  Top 0.406: AX2.21 113.98,124.78 v113.98,133.67 | ECS.AM2 EDAC.AM2
  Bottom 0.406: v113.98,133.67 107.63,140.02 107.63,145.1 ECS.AM2
N$30  (via drill 0.81)
  Top 0.406: DEC.AN2 EDAC.AN2 ECS.AN2 104.46,143.51 104.46,138.43 105.41,137.48 v105.41,120.33
  Bottom 0.406: AX2.23 110.49,123.19 110.49,120.33 v105.41,120.33
N$31  (via drill 0.81)
  Top 0.406: v109.22,133.67 AX2.25 | ECS.AP2 EDAC.AP2
  Bottom 0.406: v109.22,133.67 104.46,138.43 104.46,143.51 102.55,143.51 100.97,145.1 ECS.AP2
N$32  (via drill 0.81)
  Top 0.406: DEC.AR2 EDAC.AR2 ECS.AR2 | v106.68,134.62 AX2.27
  Bottom 0.406: v106.68,134.62 101.28,140.02 101.28,143.51 98.11,143.51 ECS.AR2
N$33  (via drill 0.81)
  Top 0.406: v104.14,130.81 AX2.29 | ECS.AS2 EDAC.AS2
  Bottom 0.406: v104.14,130.81 94.93,140.02 94.93,145.1 ECS.AS2
N$34
  Top 0.406: ECS.AT2 EDAC.AT2 DEC.AT2 90.17,150.81 100.01,150.81 101.28,149.54 101.28,124.78 AX2.31
N$35  (via drill 0.81)
  Top 0.406: AX2.33 98.74,124.78 v98.74,129.86 | ECS.AU2 EDAC.AU2
  Bottom 0.406: v98.74,129.86 88.58,140.02 88.58,145.1 ECS.AU2
N$36  (via drill 0.81)
  Top 0.406: DEC.AV2 EDAC.AV2 ECS.AV2 85.41,143.51 85.41,126.05 v85.09,125.73
  Bottom 0.406: AX2.35 95.25,125.73 v85.09,125.73
N$37
  Top 0.406: BX2.1 66.36,127.32 66.36,143.51 ECS.BA2 EDAC.BA2
N$38
  Top 0.406: DEC.BB2 EDAC.BB2 ECS.BB2 63.18,143.51 63.18,126.68 BX2.3
N$39
  Top 0.406: BX2.5 58.74,124.78 58.74,137.79 60.01,139.06 60.01,143.51 ECS.BC2 EDAC.BC2
N$40
  Top 0.406: DEC.BD2 EDAC.BD2 ECS.BD2 56.83,143.51 56.83,138.43 56.2,137.79 56.2,124.78 BX2.7
N$41
  Top 0.406: BX2.9 53.66,124.78 53.66,143.51 ECS.BE2 EDAC.BE2
N$42  (via drill 0.81)
  Top 0.406: DEC.BF2 EDAC.BF2 ECS.BF2 | v50.8,137.16 BX2.11
  Bottom 0.406: v50.8,137.16 53.66,140.02 53.66,145.1 ECS.BF2
N$43
  Top 0.406: BX2.13 49.53,125.73 49.53,137.48 50.48,138.43 50.48,143.51 ECS.BH2 EDAC.BH2
N$44
  Top 0.406: DEC.BJ2 EDAC.BJ2 ECS.BJ2 47.31,143.51 47.31,139.06 46.04,137.79 46.04,124.78 BX2.15
N$45
  Top 0.406: BX2.17 43.5,124.78 43.5,137.79 44.13,138.43 44.13,143.51 ECS.BK2 EDAC.BK2
N$46
  Top 0.406: DEC.BL2 EDAC.BL2 ECS.BL2 40.96,143.51 40.96,124.78 BX2.19
N$47
  Top 0.406: BX2.21 37.78,124.78 37.78,143.51 ECS.BM2 EDAC.BM2
N$48
  Top 0.406: DEC.BN2 EDAC.BN2 ECS.BN2 34.61,143.51 34.61,138.43 35.24,137.79 35.24,124.78 BX2.23
N$49
  Top 0.406: BX2.25 32.7,124.78 32.7,137.79 31.43,139.06 31.43,143.51 ECS.BP2 EDAC.BP2
N$50
  Top 0.406: DEC.BR2 EDAC.BR2 ECS.BR2 28.26,143.51 28.26,138.43 30.16,136.53 30.16,124.78 BX2.27
N$51
  Top 0.406: BX2.29 25.08,127.32 25.08,143.51 ECS.BS2 EDAC.BS2
N$52  (via drill 0.81)
  Top 0.406: DEC.BT2 EDAC.BT2 ECS.BT2 21.91,143.51 v21.91,126.36
  Bottom 0.406: BX2.31 23.5,126.36 v21.91,126.36
N$53
  Top 0.406: ECS.BU2 EDAC.BU2
  Bottom 0.406: BX2.33 21.59,123.19 15.88,123.19 12.38,126.68 12.38,143.51 15.56,143.51 ECS.BU2
N$54
  Top 0.406: DEC.BV2 EDAC.BV2 ECS.BV2 13.97,143.51 17.46,143.51 18.73,142.24 18.73,126.05 BX2.35
N$55  (via drill 0.81)
  Top 0.406: ECS.BA1 EDAC.BA1 DEC.BA1 67.94,109.22 v66.04,107.31
  Bottom 0.406: BX1.1 64.14,107.31 v66.04,107.31
N$56  (via drill 0.81)
  Top 0.406: BX1.3 60.64,107 v60.64,116.84 | EDAC.BB1 ECS.BB1
  Bottom 0.406: v60.64,116.84 56.83,120.65 55.24,120.65 54.61,121.28 54.61,136.84 61.59,136.84 64.77,140.02 EDAC.BB1
N$57  (via drill 0.81)
  Top 0.406: ECS.BC1 EDAC.BC1 DEC.BC1 59.69,136.84 59.69,121.28 64.45,116.52 64.45,112.71 v64.77,112.39 | v58.42,112.39 BX1.5
  Bottom 0.406: v64.77,112.39 v58.42,112.39
N$58  (via drill 0.81)
  Top 0.406: v63.5,109.86 63.5,115.57 58.42,120.65 57.15,120.65 57.15,137.48 58.42,138.75 EDAC.BD1 ECS.BD1
  Bottom 0.406: BX1.7 59.05,109.86 v63.5,109.86
N$59  (via drill 0.81)
  Top 0.406: ECS.BE1 EDAC.BE1 DEC.BE1 | v53.34,117.47 BX1.9
  Bottom 0.406: v53.34,117.47 51.12,119.7 48.58,119.7 46.99,121.28 46.99,135.89 52.39,135.89 DEC.BE1
N$60
  Top 0.406: BX1.11 52.07,107.95 EDAC.BF1 ECS.BF1
N$61
  Top 0.406: ECS.BH1 EDAC.BH1 DEC.BH1 46.99,136.84 46.99,121.28 48.26,120.02 BX1.13
N$62
  Top 0.406: BX1.15 44.45,107.95 44.45,137.48 45.72,138.75 EDAC.BJ1 ECS.BJ1
N$63
  Top 0.406: ECS.BK1 EDAC.BK1 DEC.BK1 41.91,138.11 41.91,107.95 BX1.17
N$64
  Top 0.406: BX1.19 39.37,107.95 EDAC.BL1 ECS.BL1
N$65
  Top 0.406: ECS.BM1 EDAC.BM1 DEC.BM1 36.83,138.11 36.83,107.95 BX1.21
N$66
  Top 0.406: BX1.23 35.56,120.02 34.29,121.28 34.29,137.48 33.02,138.75 EDAC.BN1 ECS.BN1
N$67
  Top 0.406: ECS.BP1 EDAC.BP1 DEC.BP1 31.75,136.84 31.75,107.95 BX1.25
N$68
  Top 0.406: BX1.27 30.16,107 30.16,120.33 29.21,121.28 29.21,136.21 26.67,138.75 EDAC.BR1 ECS.BR1
N$69
  Top 0.406: ECS.BS1 EDAC.BS1 DEC.BS1 24.13,138.11 24.13,110.49 BX1.29
N$70
  Top 0.406: BX1.31 21.59,110.49 21.59,125.09 20.32,126.36 EDAC.BT1 ECS.BT1
N$71  (via drill 0.81)
  Top 0.406: ECS.BU1 EDAC.BU1 DEC.BU1 17.14,112.39 v17.46,112.08
  Bottom 0.406: v17.46,112.08 BX1.33
N$72  (via drill 0.81)
  Top 0.406: v16.19,110.81 16.19,137.79 13.97,140.02 EDAC.BV1 ECS.BV1
  Bottom 0.406: v16.19,110.81 BX1.35
N$73
  Bottom 0.406: GREEN.K 58.42,22.86 R2.2
N$74
  Bottom 0.406: RED1.K 73.66,22.86 R3.2
N$75
  Bottom 0.406: YELLOW.K 88.9,22.86 R4.2
N$76
  Bottom 0.406: RED2.K 104.14,22.86 R5.2
N$77
  Top 0.406: R7.1 R6.1 LOADL3.1
N$78
  Top 0.406: R9.1 R8.1 LOADL1.1
N$79
  Top 0.406: LOADHI1.1 R11.2
N$80
  Top 0.406: LOADHI3.1 R10.2
N$81
  Bottom 0.406: IC3.23 R15.1
N$82
  Top 0.406: UUT_PWR.K R13.2 R12.2
N$83
  Bottom 0.406: R14.2 PWR.K
N$84
  pour Top (isolate 0.406): 62.23,38.1 78.74,38.1 78.74,48.26 62.23,48.26
N$85
  Top 0.813: J2.5 24.13,52.7 29.53,47.31 29.53,22.86 20.32,13.65 UUT.5
N$89
  Top 0.406: REG3.2 D2.C
  Bottom 0.406: REG3.2 86.04,41.59 86.36,41.91 L1.1
N$90
  Top 0.406: C11.2 80.01,38.1 80.01,45.4 81.28,46.67 REG3.5
N$91
  Top 0.406: C11.1 76.2,31.75 R20.1
N$92
  Bottom 0.406: REG2.2 54.61,34.29 | D1.C 54.61,34.29 | 54.61,34.29 L2.1
N$93
  Top 0.406: REG2.1 R18.2 | REG2.7 REG2.8
  Bottom 0.406: REG2.8 REG2.1
N$94
  Top 0.406: R19.1 R21.1 R20.2 C10.1 91.44,32.07 REG3.1
N$95  (via drill 0.81)
  Top 0.406: v56.52,36.51 57.15,37.15 C8.1
  Bottom 0.406: REG2.3 48.58,36.51 v56.52,36.51
N$107
  Top 0.406: R1.1 132.08,55.88 IC1.28
N$112
  Bottom 0.813: REG1.1 R23.2 R22.1
N$116
  Bottom 0.813: D4.C D5.A
PROBE1  (via drill 0.81)
  Top 0.406: v36.2,66.04 37.15,65.09 37.15,52.07 40.96,48.26 v40.96,41.91
  Bottom 0.406: v36.2,66.04 IC5.25 | v40.96,41.91 44.77,38.1 57.15,38.1 62.23,33.02 137.16,33.02 PROBE1.1
PROBE2  (via drill 0.81)
  Top 0.406: IC5.26 38.1,60.96 38.1,53.34 v40.96,50.48
  Bottom 0.406: v40.96,50.48 41.27,50.16 70.8,50.16 72.07,48.9 128.91,48.9 PROBE2.1
PROBE3  (via drill 0.81)
  Top 0.406: IC5.27 39.37,59.69 v39.37,53.66
  Bottom 0.406: v39.37,53.66 40.96,52.07 142.88,52.07 146.05,48.9 146.05,40.64 PROBE3.1
PROBE4  (via drill 0.81)
  Top 0.406: v70.48,56.2 71.75,54.93 v71.75,50.8
  Bottom 0.406: IC5.28 42.86,56.2 v70.48,56.2 | v71.75,50.8 142.24,50.8 PROBE4.1
SI/GPIO10  (via drill 0.81)
  Top 0.406: v23.5,81.28 26.67,84.45 v26.67,85.72
  Bottom 0.406: 116.84,90.17 95.25,90.17 IC3.13 87.95,88.9 86.68,90.17 71.12,90.17 | IC2.13 116.84,90.17 | IC1.13 138.43,90.17 116.84,90.17 | 71.12,90.17 49.53,90.17 IC5.13 46.99,87.63 28.57,87.63 v26.67,85.72 | IC4.13 71.12,90.17 | RASPI.19 10.16,81.28 v23.5,81.28
SO/GPIO9
  Bottom 0.406: 93.98,92.71 IC3.14 | 93.98,92.71 72.39,92.71 IC4.14 65.41,91.44 64.14,92.71 49.53,92.71 IC5.14 46.99,90.17 40.32,90.17 36.51,93.98 15.88,93.98 14.61,92.71 3.81,92.71 3.81,88.27 4.45,87.63 6.35,87.63 RASPI.21 | 116.84,92.71 IC2.14 | 93.98,92.71 116.84,92.71 | IC1.14 138.43,92.71 116.84,92.71
V+  (via drill 0.81)
  Top 0.813: R15.2 80.01,64.77 V+.8 V+.7 V+.6 V+.5 V+.4 V+.3 V+.2 V+.1 80.01,124.14 v84.14,128.27 | R6.2 R7.2 R8.2 R9.2 129.54,23.18 127.32,25.4 127.32,53.34 R1.2
  Bottom 0.813: BX2.2 70.17,121.92 71.75,123.51 73.03,123.51 74.61,121.92 V+.1 | AX2.2 142.24,124.46 142.88,124.46 143.51,125.09 | 143.51,125.09 143.51,128.59 116.52,128.59 116.2,128.27 v84.14,128.27 | VPP0.1 12.7,20.32 UUT_PWR.A 15.56,17.78 20,13.34 25.08,13.34 | R6.2 149.22,22.86 149.22,120.97 148.59,121.6 147.32,121.6 143.83,125.09 143.51,125.09 | UUT.6 25.08,11.37 25.08,13.34 | R9.2 117.79,11.11 58.1,11.11 54.93,14.29 26.35,14.29 25.4,13.34 25.08,13.34
V-  (via drill 0.81)
  Top 0.813: V-.8 V-.7 V-.6 V-.5 V-.4 V-.3 V-.2 | SV1.1 v137.16,129.86
  Bottom 0.813: -V.1 5.08,22.54 3.49,20.95 3.49,14.29 15.56,14.29 18.1,11.75 18.1,8.57 22.86,8.57 24.77,6.67 UUT.3 25.4,6.35 28.26,3.49 134.62,3.49 150.5,19.37 150.5,129.86 v137.16,129.86 | V-.2 V-.1 87,121.92 82.07,126.84 | SV2.1 63.5,129.54 79.38,129.54 82.07,126.84 | SV1.1 82.23,127 82.07,126.84
VCC
  Top 0.813: RASPI.4 RASPI.2
  Bottom 0.813: 22.86,46.99 R22.2 D4.A 26.67,39.37 C1.+ | REG1.2 21.59,46.99 22.86,46.99 | 21.59,58.42 7.62,58.42 RASPI.2 | 21.59,58.42 J2.4 | 21.59,58.42 21.59,50.8 22.86,49.53 22.86,46.99
  pour Top (isolate 0.406): 1.27,41.91 20.32,41.91 20.32,52.07 1.27,52.07
VDD  (via drill 0.81)
  Top 0.813: v96.2,88.9 95.57,88.27 95.57,80.33 IC3.9 88.9,73.66 88.9,54.61 C4.1 73.03,53.34 73.03,78.74 | 135.89,78.74 135.89,55.88 C6.1 | 135.89,78.74 v135.89,91.44 | v137.16,78.74 135.89,78.74 | C3.1 65.41,53.98 v65.41,58.42 | v67.94,60.96 69.53,62.55 69.53,77.15 IC4.9 73.03,78.74 | PWR.A 42.86,17.78 42.86,25.08 | 42.86,25.08 42.86,41.91 42.23,42.55 42.23,53.02 C2.1 42.23,53.34 42.23,77.47 43.18,78.42 v43.18,78.74 42.23,79.69 42.23,84.77 IC5.17 42.23,87.95 42.23,91.44 | 42.86,25.08 35.56,25.08 v35.56,27.94 | v68.58,86.36 v68.58,93.98 71.12,93.98 73.03,92.08 v73.03,88.9 73.03,78.74 | v43.5,94.93 43.5,92.71 42.23,91.44 | 42.23,91.44 IC5.15 | IC3.16 IC3.15 | IC2.9 119.06,80.96 119.06,91.76 v116.84,93.98 | v112.08,88.9 v112.08,93.98 | v22.86,57.15 J2.3
  Bottom 0.813: v43.18,78.74 IC5.9 | v96.2,88.9 IC2.16 v112.08,88.9 | 109.06,54.77 108.9,54.93 89.22,54.93 C4.1 | 109.06,54.77 C5.1 | C6.1 131.76,54.93 109.22,54.93 109.06,54.77 | v137.16,78.74 IC1.9 | v67.94,60.96 v65.41,58.42 | D5.C 29.53,27.94 | 29.53,27.94 v35.56,27.94 | v22.86,57.15 22.86,53.98 29.53,47.31 29.53,27.94 | IC4.17 v68.58,86.36 | v68.58,93.98 67.63,94.93 v43.5,94.93 | IC3.16 v73.03,88.9 | v116.84,93.98 v112.08,93.98 | IC1.15 v135.89,91.44
VPPCTL
  Bottom 0.406: REG2.5 R16.2 R17.1
VSS  (via drill 0.81)
  Top 0.813: 9.21,91.44 9.21,107.63 RASPI.39 6.03,110.81 3.49,110.81 3.49,101.6 | 3.49,76.2 3.49,66.04 | 3.49,76.2 3.49,83.82 | 3.49,83.82 3.49,96.52 | 3.49,96.52 3.49,101.6 | RASPI.9 9.21,72.71 9.21,91.44 | v66.67,88.9 66.67,81.28 | 66.67,81.28 IC4.10 | 66.67,81.28 66.67,56.83 69.85,53.66 C3.2 69.85,50.8 | IC1.10 141.29,79.69 141.29,56.52 138.43,53.66 C6.2 | 115.25,56.2 115.25,53.34 C5.2 | 115.25,56.2 115.25,59.69 | 115.25,59.69 v115.25,67.31 | C4.2 108.9,53.34 108.9,53.66 114.94,59.69 115.25,59.69 | v91.12,72.39 92.39,71.12 92.39,53.34 C4.2 | v115.57,56.2 115.25,56.2 | 22.86,46.99 22.86,43.18 18.73,39.05 18.73,35.24 | 22.86,46.99 22.86,52.07 J2.1 11.43,58.42 5.08,58.42 3.49,60.01 3.49,66.04 | 60.96,50.8 v60.96,53.34 60.96,55.88 53.34,63.5 53.34,78.74 v50.8,81.28 | 69.85,50.8 60.96,50.8 | 69.85,50.8 71.12,49.53 92.08,49.53 92.08,53.34 C4.2 | 60.96,50.8 60.96,15.56 63.5,13.02 R2.1 | RASPI.14 3.49,76.2 | RASPI.20 3.49,83.82 | RASPI.25 9.21,91.44 | RASPI.34 3.49,101.6 | RASPI.30 3.49,96.52 | R23.1 18.73,29.53 18.73,35.24 | 18.73,35.24 13.97,35.24 11.43,37.78 8.89,37.78 18V_IN.2 | IC2.15 110.81,89.85 110.81,87.95 IC2.17 111.76,83.82 v111.76,81.28 | v137.16,88.9 v137.16,81.28 | v43.5,88.9 v43.5,81.28 | IC4.15 IC4.16 | IC1.16 IC1.17 | v92.08,86.36 92.08,83.5 IC3.10 | C1.- 22.86,46.99 | RASPI.6 3.49,66.04
  Bottom 0.813: R5.1 R4.1 R3.1 R2.1 58.42,12.7 R14.1 50.48,20.32 48.9,21.91 8.89,21.91 8.89,37.78 18V_IN.2 | 115.25,81.28 IC2.10 | v115.25,67.31 115.25,81.28 | IC3.10 91.76,81.28 91.12,80.64 v91.12,72.39 | C6.2 137.16,54.61 133.99,54.61 132.4,56.2 v115.57,56.2 | v60.96,53.34 C2.2 | v50.8,81.28 IC5.10 v43.5,81.28 | IC1.16 v137.16,88.9 | v137.16,81.28 IC1.10 | 115.25,81.28 v111.76,81.28 | IC5.16 v43.5,88.9 | IC4.16 v66.67,88.9 | IC3.17 v92.08,86.36

## Text on the board
Top: - | ON
tPlace: BV | BA | AV | AA | M | R | M/R Series Flip-Chip Tester | Based on design by Warren Stearns